# Altium schematic sheet POWER.SchDoc: Peso
size A4; ApprovedBy: Adolfo de Souza Serique; CheckedBy: Adolfo de Souza Serique; Author: Adolfo de Souza Serique; CompanyName: Agym; DrawnBy: Adolfo de Souza Serique; Engineer: Adolfo de Souza Serique; DocumentNumber: 1; Revision: 1; SheetNumber: 1; SheetTotal: 2; Size: A4
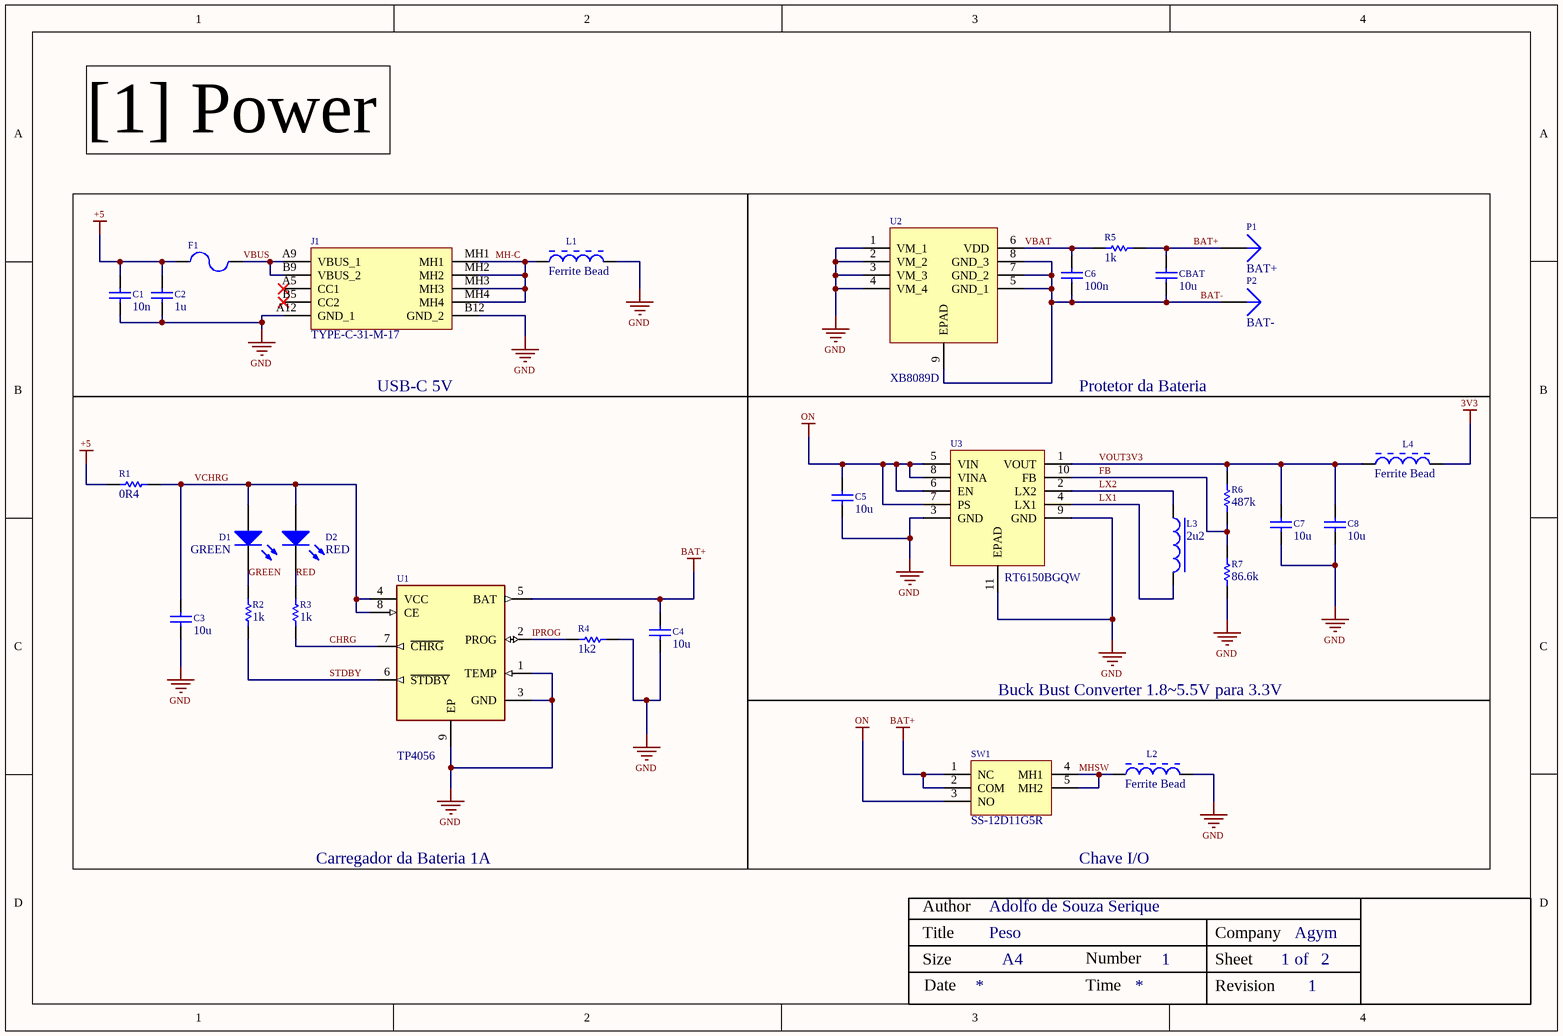
[diagram p0: POWER.SchDoc]

## Parts
C1  10n  [C2012[0805]]
C2  1u  [C2012[0805]]
C3  10u  [C3216[1206]]
C4  10u  [C3216[1206]]
C5  10u  [C2012[0805]]
C6  100n  [C2012[0805]]
C7  10u  [C2012[0805]]
C8  10u  [C2012[0805]]
CBAT  10u  [C3216[1206]]
D1  GREEN  [LED-0603-G]
D2  RED  [LED-0603-R]
F1  Resettable Fuse  [0805]  (value not drawn)
J1  TYPE-C-31-M-17  [TYPE C - 6 PINS]
L1  Ferrite Bead  [0805]
L2  Ferrite Bead  [0603]
L3  2u2  [INDUTOR 3.2x2.5mm]
L4  Ferrite Bead  [0603]
P1  BAT+  [PIN1]
P2  BAT-  [PIN1]
R1  0R4  [R3216[1206]]
R2  1k  [R1608[0603]]
R3  1k  [R1608[0603]]
R4  1k2  [R1608[0603]]
R5  1k  [R2012[0805]]
R6  487k  [R1608[0603]]
R7  86.6k  [R1608[0603]]
SW1  SS-12D11G5R  [SS-12D11G5R]
U1  TP4056  [SOP8-EPAD]
U2  XB8089D  [SOP8-EPAD]
U3  RT6150BGQW  [WDFN-10_EPAD 3x3]

## Nets
3V3: L4.2
+5: C1.1 C2.2 F1.1 R1.1
BAT+: C4.2 CBAT.2 P1.1 R5.2 SW1.1(NC) SW1.2(COM) U1.5(BAT)
GND: C1.2 C2.1 C3.1 C4.1 C5.2 C7.2 C8.2 J1.A12(GND_1) J1.B12(GND_2) L1.2 L2.2 R4.2 R7.1 U1.1(TEMP) U1.3(GND) U1.9(EP) U2.1(VM_1) U2.2(VM_2) U2.3(VM_3) U2.4(VM_4) U3.3(GND) U3.9(GND) U3.11(EPAD)
ON: C5.1 SW1.3(NO) U3.5(VIN) U3.6(EN) U3.7(PS) U3.8(VINA)
BAT-: C6.1 CBAT.1 P2.1 U2.5(GND_1) U2.7(GND_2) U2.8(GND_3) U2.9(EPAD)
CHRG: R3.1 U1.7(~{CHRG})
FB: R6.1 R7.2 U3.10(FB)
GREEN: D1.2(K) R2.2
IPROG: R4.1 U1.2(PROG)
LX1: L3.2 U3.4(LX1)
LX2: L3.1 U3.2(LX2)
MH-C: J1.MH1 J1.MH2 J1.MH3 J1.MH4 L1.1
MHSW: L2.1 SW1.4(MH1) SW1.5(MH2)
RED: D2.2(K) R3.2
STDBY: R2.1 U1.6(~{STDBY})
VBAT: C6.2 R5.1 U2.6(VDD)
VBUS: F1.2 J1.A9(VBUS_1) J1.B9(VBUS_2)
VCHRG: C3.2 D1.1(A) D2.1(A) R1.2 U1.4(VCC) U1.8(CE)
VOUT3V3: C7.1 C8.1 L4.1 R6.2 U3.1(VOUT)

Not connected (* = marked no-connect by the designer): J1 A5(CC1)* B5(CC2)*

## Notes on the sheet
- [1] Power
- USB-C 5V
- Protetor da Bateria
- Buck Bust Converter 1.8~5.5V para 3.3V
- Carregador da Bateria 1A
- Chave I/O
- Author
- Title
- Size
- Date
- Number
- Time
- Revision
- Sheet
- Company
- of

## Library data of the parts
C1 = C: CAP CER 10000PF 50V C0G/NP0 0805; Manufacturer Part Number: CL21C103JBFNNNE; Value: 1; Capacitance: 10nF; Tolerance: 5%; Dielectric: C0G; Manufacturer: *; PartNumber: *; Package Type: *; Supplier 1: Mouser; Supplier Part Number 1: 187-CL21C103JBFNNNE; RoHS: Yes; Category: Ceramic Capacitors; Stock 1: 125167; Pricing 1: 1=0,38000, 10=0,17500, 50=0,17500, 100=0,14900, 1000=0,09200, 10000=0,08000 (USD); Mount: Surface Mount; Case/Package: 0805; Case Code (Metric): 2012; Case Code (Imperial): 0805; Min Operating Temperature: -55°C; Max Operating Temperature: 125°C; Package Quantity: 1; Packaging: Tape and Reel; Voltage Rating: 50V; Series: CL; Voltage Rating (DC): 50V; Construction: Flat; Length: 2mm; Width: 0.049inch; Height: 1.25mm; Thickness: 0.053inch; Depth: 1.25mm; Radiation Hardening: No; Lead Free: Lead Free; RoHS Compliant: Yes; ComponentLink1URL: https://datasheet.ciiva.com/25787/cl21c103jbfnnne-25787207.pdf?src-supplier=Digi-Key; ComponentLink1Description: https://datasheet.ciiva.com/25787/cl21c103jbfnnne-25787207.pdf?src-supplier=Digi-Key; LCSC Part Number: C27071
C2 = C: CAP CER 1UF 50V X7R 0805; Manufacturer Part Number: CL21B105KBFNNNE; Value: 1; Tolerance: 10%; Manufacturer: *; PartNumber: *; Package Type: *; Supplier 1: Arrow Electronics; Supplier Part Number 1: CL21B105KBFNNNE; RoHS: Yes; Category: Ceramic Capacitors; Stock 1: 2742000; Pricing 1: 2000=0,01400 (USD); Mount: Surface Mount; Case/Package: 0805; Case Code (Metric): 2012; Case Code (Imperial): 0805; Min Operating Temperature: -55°C; Max Operating Temperature: 125°C; Packaging: Tape and Reel; Package Quantity: 1; Capacitance: 1uF; Voltage Rating: 50V; Dielectric: X7R; Voltage: 50V; Series: CL; Construction: Flat; Length: 2mm; Width: 0.049inch; Height: 1.25mm; Thickness: 0.053inch; Depth: 1.25mm; Radiation Hardening: No; RoHS Compliant: Yes; ComponentLink1URL: https://datasheet.ciiva.com/25800/cl21b105kbfnnne-25800291.pdf?src-supplier=Digi-Key; ComponentLink1Description: https://datasheet.ciiva.com/25800/cl21b105kbfnnne-25800291.pdf?src-supplier=Digi-Key; ComponentLink2URL: https://datasheet.ciiva.com/16449/cl21b105kbfnnne-16449003.pdf?src-supplier=Future+Electronics; ComponentLink2Description: https://datasheet.ciiva.com/16449/cl21b105kbfnnne-16449003.pdf?src-supplier=Future+Electronics; ComponentLink3URL: https://datasheet.ciiva.com/26838/getdatasheetpartid-354075-26838668.pdf?src-supplier=Verical; ComponentLink3Description: https://datasheet.ciiva.com/26838/getdatasheetpartid-354075-26838668.pdf?src-supplier=Verical; LCSC Part Number: C28323
C3 C4 CBAT = C: Ceramic capacitor SMD-1206 10000nF (10uF) /25V X7R# K 10%, Samsung, RoHS/4k/; Manufacturer Part Number: CL31B106KAHNNNE; Value: 1; Dielectric: X7R; Voltage Rating: 25V; Manufacturer: *; PartNumber: *; Package Type: *; Supplier 1: Arrow Electronics; Supplier Part Number 1: CL31B106KAHNNNE; RoHS: Yes; Category: Ceramic Capacitors; Stock 1: 6156000; Pricing 1: 2000=0,05040, 4000=0,04570, 10000=0,04200, 14000=0,04130, 50000=0,03340 (USD); Mount: Surface Mount; Case/Package: 1206; Case Code (Metric): 3216; Case Code (Imperial): 1206; Min Operating Temperature: -55°C; Max Operating Temperature: 125°C; Tolerance: 10%; Capacitance: 10uF; Packaging: Tape and Reel; Package Quantity: 1; Voltage: 25V; Series: CL; Construction: Flat; Length: 3.2mm; Width: 0.063inch; Height: 1.6mm; Thickness: 0.071inch; Depth: 1.6mm; Radiation Hardening: No; RoHS Compliant: Yes; ComponentLink1URL: https://datasheet.ciiva.com/25795/cl31b106kahnnne-25795260.pdf?src-supplier=Digi-Key; ComponentLink1Description: https://datasheet.ciiva.com/25795/cl31b106kahnnne-25795260.pdf?src-supplier=Digi-Key; ComponentLink2URL: https://datasheet.ciiva.com/26838/getdatasheetpartid-356415-26838914.pdf?src-supplier=Verical; ComponentLink2Description: https://datasheet.ciiva.com/26838/getdatasheetpartid-356415-26838914.pdf?src-supplier=Verical; ComponentLink3URL: https://datasheet.ciiva.com/16498/cl03a105mq3csnc-16498474.pdf?src-supplier=Future+Electronics; ComponentLink3Description: https://datasheet.ciiva.com/16498/cl03a105mq3csnc-16498474.pdf?src-supplier=Future+Electronics; LCSC Part Number: C14860
C5 C7 C8 = C: Cap Ceramic 10uF 16V X7R 10% SMD 0805 125°C Emboss T/R; Manufacturer Part Number: CL21B106KOQNNNE; Value: 1; Manufacturer: *; PartNumber: *; Package Type: *; Supplier 1: Arrow Electronics; Supplier Part Number 1: CL21B106KOQNNNE; RoHS: Yes; Category: Ceramic Capacitors; Stock 1: 34765; Pricing 1: 1=0,25820, 10=0,19230, 25=0,18120, 100=0,10130, 250=0,09520, 500=0,09430, 1000=0,09320, 3000=0,06070, 6000=0,05250, 15000=0,04590, 30000=0,04250 (USD); Mount: Surface Mount; Case/Package: 0805; Case Code (Metric): 2012; Case Code (Imperial): 0805; Contact Plating: Tin; Min Operating Temperature: -55°C; Max Operating Temperature: 125°C; Tolerance: 10%; Packaging: Tape and Reel; Capacitance: 10uF; Voltage Rating: 16V; Package Quantity: 1; Dielectric: X7R; Series: CL; Construction: Flat; Voltage: 16V; Length: 2mm; Width: 0.049inch; Height: 1.25mm; Thickness: 0.055inch; Depth: 1.25mm; Radiation Hardening: No; RoHS Compliant: Yes; ComponentLink1URL: https://datasheet.ciiva.com/25794/cl21b106koqnnne-25794472.pdf?src-supplier=Digi-Key; ComponentLink1Description: https://datasheet.ciiva.com/25794/cl21b106koqnnne-25794472.pdf?src-supplier=Digi-Key; ComponentLink2URL: https://datasheet.ciiva.com/16428/cl21b106koqnnne-16428887.pdf?src-supplier=Future+Electronics; ComponentLink2Description: https://datasheet.ciiva.com/16428/cl21b106koqnnne-16428887.pdf?src-supplier=Future+Electronics; ComponentLink3URL: https://datasheet.ciiva.com/26920/getdatasheetpartid-355170-26920201.pdf?src-supplier=Verical; ComponentLink3Description: https://datasheet.ciiva.com/26920/getdatasheetpartid-355170-26920201.pdf?src-supplier=Verical; LCSC Part Number: C95841
C6 = C: CAP CER 0.1UF 50V X7R 0805; Manufacturer Part Number: CL21B104JBCNNNC; Value: 1; Material: Ceramic; Capacitance: 100nF; Tolerance: 5%; Manufacturer: *; PartNumber: *; Package Type: *; Supplier 1: Arrow Electronics; Supplier Part Number 1: CL21B104JBCNNNC; RoHS: Yes; Category: Ceramic Capacitors; Stock 1: 41; Pricing 1: 1=0,08950, 25=0,06360, 50=0,03810, 100=0,02270, 250=0,02120, 500=0,01290, 4000=0,00970 (USD); Mount: Surface Mount; Case/Package: 0805; Case Code (Metric): 2012; Case Code (Imperial): 0805; Contact Plating: Tin; Min Operating Temperature: -55°C; Max Operating Temperature: 125°C; Dielectric: X7R; Package Quantity: 1; Packaging: Tape and Reel; Voltage Rating: 50V; Voltage: 50V; Series: CL; Construction: Flat; Length: 2mm; Width: 0.049inch; Height: 0.85mm; Thickness: 0.037inch; Depth: 1.25mm; Radiation Hardening: No; RoHS Compliant: Yes; ComponentLink1URL: https://datasheet.ciiva.com/25799/cl21b104jbcnnnc-25799232.pdf?src-supplier=Digi-Key; ComponentLink1Description: https://datasheet.ciiva.com/25799/cl21b104jbcnnnc-25799232.pdf?src-supplier=Digi-Key; ComponentLink2URL: https://datasheet.ciiva.com/26838/getdatasheetpartid-354073-26838656.pdf?src-supplier=Verical; ComponentLink2Description: https://datasheet.ciiva.com/26838/getdatasheetpartid-354073-26838656.pdf?src-supplier=Verical; ComponentLink3URL: https://datasheet.ciiva.com/29199/454108-da-01-en-vs-kondensator-0805-29199802.pdf?src-supplier=Conrad; ComponentLink3Description: https://datasheet.ciiva.com/29199/454108-da-01-en-vs-kondensator-0805-29199802.pdf?src-supplier=Conrad; ComponentLink4URL: https://datasheet.ciiva.com/16508/hsm00000015872757-16508637.pdf?src-supplier=Future+Electronics; ComponentLink4Description: https://datasheet.ciiva.com/16508/hsm00000015872757-16508637.pdf?src-supplier=Future+Electronics; LCSC Part Number: C62912
D1 = LED: Manufacturer: Yongyu Photoelectric; Manufacturer Part Number: SZYY0603G; Package Type: 0603; LCSC Part Number: C434420; Supplier Part Number 1: SZYY0603G
D2 = LED: Manufacturer: Yongyu Photoelectric; Manufacturer Part Number: SZYY0603R; Package Type: 0603; LCSC Part Number: C434419; Supplier Part Number 1: SZYY0603R
F1 = Resettable Fuse: Manufacturer: DOWO; Manufacturer Part Number: SMD0805-110; LCSC Part Number: C70062; Supplier Part Number 1: SMD0805-110
J1 = TYPE-C-31-M-17: 6 Pins USB Type C; Manufacturer: Korean Hroparts Elec; Datasheet Link: https://datasheet.lcsc.com/szlcsc/1903211732_Korean-Hroparts-Elec-TYPE-C-31-M-17_C283540.pdf; Manufacturer Part Number: TYPE-C-31-M-17; Supplier Part Number 1: TYPE-C-31-M-17; LCSC Part Number: C283540
L1 = Ferrite Bead: Ferrite Beads Multi-Layer 220Ohm 25% 100MHz 2A 45mOhm DCR 0805 Paper T/R; Manufacturer: Murata; Manufacturer Part Number: BLM21PG221SN1D; Material: Ferrite,Steel; Impedance: 220R; Number of Lines: 1; DC Resistance (DCR): 45mR; Shielding: Unshielded; LCSC Part Number: C85840; Supplier 1: RSComponents; Supplier Part Number 1: 7241532; RoHS: Yes; Category: Ferrite Beads and Chips; Stock 1: 3700; Pricing 1: 25=0,05900, 500=0,05000, 1000=0,04400, 2500=0,03800, 5000=0,03600 (GBP); Case/Package: 0805; Number of Pins: 2; Core Material: Ferrite; Case Code (Metric): 2012; Case Code (Imperial): 0805; Contact Plating: Tin,Matte; Min Operating Temperature: -55°C; Max Operating Temperature: 125°C; Package Quantity: 1; Tolerance: 25%; Max Current Rating: 2A; Packaging: Tape and Reel; Current Rating: 2A; Max DC Current: 2A; Termination: SMD/SMT; Test Frequency: 100MHz; DC Current: 2A; Frequency: 100MHz; Number of Circuits: 1; Current: 2A; Series: BLM21P; DC Resistance-Max: 45mR; Length: 2mm; Width: 1.25mm; Height: 0.85mm; Depth: 1.25mm; Radiation Hardening: No; REACH SVHC: No SVHC; Military Standard: Not; Lead Free: Lead Free; RoHS Compliant: Yes; ComponentLink1URL: https://datasheet.ciiva.com/30514/1845321-30514028.pdf?src-supplier=Jameco; ComponentLink1Description: https://datasheet.ciiva.com/30514/1845321-30514028.pdf?src-supplier=Jameco; ComponentLink2URL: https://datasheet.ciiva.com/1012/l0110s0100blm21p-1012288.pdf?src-supplier=Digi-Key; ComponentLink2Description: https://datasheet.ciiva.com/1012/l0110s0100blm21p-1012288.pdf?src-supplier=Digi-Key; ComponentLink3URL: https://datasheet.ciiva.com/11799/0900766b81275e31-11799232.pdf?src-supplier=RSComponents; ComponentLink3Description: https://datasheet.ciiva.com/11799/0900766b81275e31-11799232.pdf?src-supplier=RSComponents; ComponentLink4URL: https://datasheet.ciiva.com/29348/442529-da-01-en-chip-drossel-0805-220r-2000ma-2-0x1-25mm-29348007.pdf?src-supplier=Conrad; ComponentLink4Description: https://datasheet.ciiva.com/29348/442529-da-01-en-chip-drossel-0805-220r-2000ma-2-0x1-25mm-29348007.pdf?src-supplier=Conrad; ComponentLink5URL: https://datasheet.ciiva.com/8021/1756152-8021596.pdf?src-supplier=Element14; ComponentLink5Description: https://datasheet.ciiva.com/8021/1756152-8021596.pdf?src-supplier=Element14; ComponentLink6URL: https://datasheet.ciiva.com/8021/1756152-8021598.pdf?src-supplier=Element14; ComponentLink6Description: https://datasheet.ciiva.com/8021/1756152-8021598.pdf?src-supplier=Element14; ComponentLink7URL: https://datasheet.ciiva.com/14122/anblm21p-data-e-14122214.pdf?src-supplier=Distrelec; ComponentLink7Description: https://datasheet.ciiva.com/14122/anblm21p-data-e-14122214.pdf?src-supplier=Distrelec; ComponentLink8URL: https://datasheet.ciiva.com/1012/l0110s0100blm21p-1012287.pdf?src-supplier=Digi-Key; ComponentLink8Description: https://datasheet.ciiva.com/1012/l0110s0100blm21p-1012287.pdf?src-supplier=Digi-Key; ComponentLink9URL: https://datasheet.ciiva.com/1012/l0110s0100blm21p-1012289.pdf?src-supplier=Digi-Key; ComponentLink9Description: https://datasheet.ciiva.com/1012/l0110s0100blm21p-1012289.pdf?src-supplier=Digi-Key; ComponentLink10URL: https://datasheet.ciiva.com/3081/l0110s0100blm21p-3081655.pdf?src-supplier=Avnet; ComponentLink10Description: https://datasheet.ciiva.com/3081/l0110s0100blm21p-3081655.pdf?src-supplier=Avnet; ComponentLink11URL: https://datasheet.ciiva.com/16215/l0110s0100blm21p-16215194.pdf?src-supplier=Future+Electronics; ComponentLink11Description: https://datasheet.ciiva.com/16215/l0110s0100blm21p-16215194.pdf?src-supplier=Future+Electronics
L2 L4 = Ferrite Bead: Ferrite Beads Multi-Layer 220Ohm 25% 100MHz 1.4A 100mOhm DCR 0603 Paper T/R; Manufacturer: TDK EPCOS; Manufacturer Part Number: MPZ1608S601ATA00; Manufacturer Series: BLM18P; Impedance: 600R; DC Resistance (DCR): 150mR; Max DC Current: 1A; Material: Steel,Ferrite; Resistance: 100mR; ESR (Equivalent Series Resistance): 220R; Number of Lines: 1; Shielding: Unshielded; LCSC Part Number: C80165; Supplier 1: Mouser; Supplier Part Number 1: 810-MPZ1608S601ATA00; RoHS: Yes; Category: Ferrite Beads and Chips; Stock 1: 23; Pricing 1: 1=0,15000, 10=0,15000, 50=0,15000, 100=0,15000, 1000=0,15000, 10000=0,15000 (USD); Mount: Surface Mount; Case/Package: 0603; Core Material: Ferrite; Case Code (Metric): 1608; Case Code (Imperial): 0603; Weight: 7.1E-05oz; Min Operating Temperature: -55°C; Max Operating Temperature: 125°C; Tolerance: 25%; Termination: SMD/SMT; Packaging: Tape and Reel; Package Quantity: 4000; Current Rating: 1A; Test Frequency: 100MHz; Series: MPZ; Length: 0.063inch; Width: 0.8mm; Height: 0.8mm; Depth: 0.8mm; RoHS Compliant: Yes; REACH SVHC: No SVHC; Lead Free: Lead Free; ComponentLink1URL: https://datasheet.ciiva.com/46381/1795297-46381701.pdf?src-supplier=Element14; ComponentLink1Description: https://datasheet.ciiva.com/46381/1795297-46381701.pdf?src-supplier=Element14; ComponentLink2URL: https://datasheet.ciiva.com/46634/beads-commercial-power-mpz-en-46634462.pdf?src-supplier=Digi-Key; ComponentLink2Description: https://datasheet.ciiva.com/46634/beads-commercial-power-mpz-en-46634462.pdf?src-supplier=Digi-Key; ComponentLink3URL: https://datasheet.ciiva.com/46634/beads-commercial-power-mpz-en-46634518.pdf?src-supplier=Digi-Key; ComponentLink3Description: https://datasheet.ciiva.com/46634/beads-commercial-power-mpz-en-46634518.pdf?src-supplier=Digi-Key; ComponentLink4URL: https://datasheet.ciiva.com/46634/beads-commercial-power-mpz-en-46634494.pdf?src-supplier=Digi-Key; ComponentLink4Description: https://datasheet.ciiva.com/46634/beads-commercial-power-mpz-en-46634494.pdf?src-supplier=Digi-Key; Supplier 2: Arrow Electronics; Supplier Part Number 2: BLM18PG221SN1D; Stock 2: 760; Pricing 2: 1=0,09530, 10=0,06790, 25=0,06440, 50=0,05150, 100=0,03370, 250=0,03340, 500=0,03250 (USD); Number of Pins: 2; Max Current Rating: 1.4A; DC Current: 1.4A; Number of Circuits: 1; Number of Functions: 1; DC Resistance-Max: 100mR; Radiation Hardening: No; ComponentLink5URL: https://datasheet.ciiva.com/19458/1845030-19458417.pdf?src-supplier=Jameco; ComponentLink5Description: https://datasheet.ciiva.com/19458/1845030-19458417.pdf?src-supplier=Jameco; ComponentLink6URL: https://datasheet.ciiva.com/11800/0900766b81275ca5-11800851.pdf?src-supplier=RSComponents; ComponentLink6Description: https://datasheet.ciiva.com/11800/0900766b81275ca5-11800851.pdf?src-supplier=RSComponents; ComponentLink7URL: https://datasheet.ciiva.com/29347/442391-da-01-en-chip-drossel-0603-220r-1400ma-1-6x0-8mm-29347986.pdf?src-supplier=Conrad; ComponentLink7Description: https://datasheet.ciiva.com/29347/442391-da-01-en-chip-drossel-0603-220r-1400ma-1-6x0-8mm-29347986.pdf?src-supplier=Conrad; ComponentLink8URL: https://datasheet.ciiva.com/8021/5148-8021482.pdf?src-supplier=Element14; ComponentLink8Description: https://datasheet.ciiva.com/8021/5148-8021482.pdf?src-supplier=Element14; ComponentLink9URL: https://datasheet.ciiva.com/8021/5148-8021479.pdf?src-supplier=Element14; ComponentLink9Description: https://datasheet.ciiva.com/8021/5148-8021479.pdf?src-supplier=Element14; ComponentLink10URL: https://datasheet.ciiva.com/14122/blm-series-eng-tds-14122909.pdf?src-supplier=Distrelec; ComponentLink10Description: https://datasheet.ciiva.com/14122/blm-series-eng-tds-14122909.pdf?src-supplier=Distrelec; ComponentLink11URL: https://datasheet.ciiva.com/1012/l0110s0100blm18p-1012162.pdf?src-supplier=Digi-Key; ComponentLink11Description: https://datasheet.ciiva.com/1012/l0110s0100blm18p-1012162.pdf?src-supplier=Digi-Key; ComponentLink12URL: https://datasheet.ciiva.com/1012/l0110s0100blm18p-1012161.pdf?src-supplier=Digi-Key; ComponentLink12Description: https://datasheet.ciiva.com/1012/l0110s0100blm18p-1012161.pdf?src-supplier=Digi-Key; ComponentLink13URL: https://datasheet.ciiva.com/1012/l0110s0100blm18p-1012163.pdf?src-supplier=Digi-Key; ComponentLink13Description: https://datasheet.ciiva.com/1012/l0110s0100blm18p-1012163.pdf?src-supplier=Digi-Key; ComponentLink14URL: https://datasheet.ciiva.com/3081/l0110s0100blm18p-3081633.pdf?src-supplier=Avnet; ComponentLink14Description: https://datasheet.ciiva.com/3081/l0110s0100blm18p-3081633.pdf?src-supplier=Avnet; ComponentLink15URL: https://datasheet.ciiva.com/16205/l0110s0100blm18p-16205422.pdf?src-supplier=Future+Electronics; ComponentLink15Description: https://datasheet.ciiva.com/16205/l0110s0100blm18p-16205422.pdf?src-supplier=Future+Electronics
L3 = Indutor: Manufacturer Part Number: HEI322512A-2R2M-Q8; Value: 2u2H; LCSC Part Number: C285914; Supplier Part Number 1: HEI322512A-2R2M-Q8
P1 P2 = Plug: LatestRevisionDate: 17-Jul-2002; LatestRevisionNote: Re-released for DXP Platform.; Publisher: Altium Limited
R1 = R: Resistor; Manufacturer: UNI-ROYAL; Manufacturer Part Number: 1206W4F400LT5E; Package Type: 1206; Value: 0R4; LCSC Part Number: C247521
R2 R3 = R: ERJ Series 0603 1 kOhm 0.2 W ±0.1 % ±50ppm/°C Thick Film Chip Resistor; Manufacturer Part Number: ERJ-PB3B1001V; Value: 0; Resistance: 1kR; Tolerance: 0.1%; Max Power Dissipation: 200mW; Manufacturer: *; PartNumber: *; Package Type: *; Supplier 1: Arrow Electronics; Supplier Part Number 1: ERJ-PB3B1001V; RoHS: Yes; Category: Chip SMD Resistors; Stock 1: 430; Pricing 1: 1=0,24170, 10=0,17640, 25=0,13980, 100=0,08630, 250=0,06400 (USD); Case/Package: 0603; Case Code (Metric): 1608; Case Code (Imperial): 0603; Min Operating Temperature: -55°C; Max Operating Temperature: 155°C; Packaging: Tape and Reel; Resistor Type: Thick Film; Number of Terminations: 2; Temperature Coefficient: 50ppm/°C; Features: Automotive AEC-Q200; Length: 0.063inch; Width: 0.032inch; Height - Seated (Max): 0.022inch; ComponentLink1URL: https://industrial.panasonic.com/sa/system/files/data/download/catalog/id_fixed-resistors_e_2.pdf?src-supplier=Digi-Key; ComponentLink1Description: https://industrial.panasonic.com/sa/system/files/data/download/catalog/id_fixed-resistors_e_2.pdf?src-supplier=Digi-Key; ComponentLink2URL: https://industrial.panasonic.com/cdbs/www-data/pdf/RDM0000/DMM0000COL5.pdf?src-supplier=Digi-Key; ComponentLink2Description: https://industrial.panasonic.com/cdbs/www-data/pdf/RDM0000/DMM0000COL5.pdf?src-supplier=Digi-Key; ComponentLink3URL: http://www.farnell.com/datasheets/2883953.pdf?src-supplier=Newark; ComponentLink3Description: http://www.farnell.com/datasheets/2883953.pdf?src-supplier=Newark; LCSC Part Number: C193680
R4 = R: Resistor; Manufacturer: UNI-ROYAL; Manufacturer Part Number: 0603WAF1201T5E; Value: 1.2k; Package Type: 0603; LCSC Part Number: C22765
R5 = R: Res Thick Film 0805 1K Ohm 1% 0.4W ±100ppm/C Epoxy Resin Pad SMD Automotive T/R; Manufacturer Part Number: ESR10EZPF1001; Value: 0; Resistance: 1kR; Temperature Coefficient: 100ppm/°C; Power Rating: 400mW; Manufacturer: *; PartNumber: *; Package Type: *; Supplier 1: Arrow Electronics; Supplier Part Number 1: ESR10EZPF1001; RoHS: Yes; Category: Chip SMD Resistors; Stock 1: 16; Pricing 1: 1=0,13760, 10=0,12760 (USD); Case/Package: 0805; Case Code (Metric): 2012; Case Code (Imperial): 0805; Size Code: 0805; Min Operating Temperature: -55°C; Max Operating Temperature: 155°C; Tolerance: 1%; Packaging: Tape and Reel; Resistor Type: Thick Film; Package Quantity: 1; Number of Terminations: 2; Max Power Dissipation: 400mW; Features: Automotive AEC-Q200; Series: ESR; Length: 0.079inch; Width: 0.049inch; Height: 0.026inch; Lead Free: Lead Free; RoHS Compliant: Yes; ComponentLink1URL: https://datasheet.ciiva.com/2470/esr-2470004.pdf?src-supplier=Digi-Key; ComponentLink1Description: https://datasheet.ciiva.com/2470/esr-2470004.pdf?src-supplier=Digi-Key; ComponentLink2URL: https://datasheet.ciiva.com/2470/esr-2470005.pdf?src-supplier=Digi-Key; ComponentLink2Description: https://datasheet.ciiva.com/2470/esr-2470005.pdf?src-supplier=Digi-Key; ComponentLink3URL: https://datasheet.ciiva.com/2470/esr-2470003.pdf?src-supplier=Digi-Key; ComponentLink3Description: https://datasheet.ciiva.com/2470/esr-2470003.pdf?src-supplier=Digi-Key; LCSC Part Number: C510097
R6 = R: Res Thick Film 0603 487K Ohm 1% 1/10W ±100ppm/°C Molded SMD Punched Carrier T/R; Manufacturer Part Number: ERJ-3EKF4873V; Value: 0; Resistance: 487kR; Power Rating: 100mW; Voltage Rating: 75V; Voltage Rating (DC): 50V; Manufacturer: *; PartNumber: *; Package Type: *; Supplier 1: Arrow Electronics; Supplier Part Number 1: ERJ-3EKF4873V; RoHS: Yes; Category: Chip SMD Resistors; Stock 1: 41000; Pricing 1: 1=0,05150, 10=0,02080, 25=0,02070, 100=0,00860, 250=0,00850, 500=0,00840, 1000=0,00470, 3000=0,00370, 6000=0,00350, 15000=0,00330, 30000=0,00310 (USD); Mount: Surface Mount; Case/Package: 0603; Case Code (Metric): 1608; Case Code (Imperial): 0603; Contact Plating: Tin; Min Operating Temperature: -55°C; Max Operating Temperature: 155°C; Tolerance: 1%; Packaging: Tape and Reel; Package Quantity: 1; Resistor Type: Thick Film; Number of Terminations: 2; Termination: SMD/SMT; Temperature Coefficient: 100ppm/°C; Max Power Dissipation: 100mW; Features: Automotive AEC-Q200; Series: ERJ; Construction: Rectangular; Resistance Tolerance: 1%; Length: 1.6mm; Width: 0.031inch; Height: 0.022inch; Depth: 0.8mm; REACH SVHC: Yes; Military Standard: Not; Lead Free: Lead Free; RoHS Compliant: Yes; ComponentLink1URL: https://datasheet.ciiva.com/22673/1678782-22673994.pdf?src-supplier=Element14; ComponentLink1Description: https://datasheet.ciiva.com/22673/1678782-22673994.pdf?src-supplier=Element14; ComponentLink2URL: https://datasheet.ciiva.com/46444/1678782-46444760.pdf?src-supplier=Element14; ComponentLink2Description: https://datasheet.ciiva.com/46444/1678782-46444760.pdf?src-supplier=Element14; ComponentLink3URL: https://datasheet.ciiva.com/24070/aoa0000ce2-24070633.pdf?src-supplier=Mouser; ComponentLink3Description: https://datasheet.ciiva.com/24070/aoa0000ce2-24070633.pdf?src-supplier=Mouser; ComponentLink4URL: https://datasheet.ciiva.com/9181/aoa0000ce2-9181606.pdf?src-supplier=Avnet; ComponentLink4Description: https://datasheet.ciiva.com/9181/aoa0000ce2-9181606.pdf?src-supplier=Avnet; LCSC Part Number: C403250
R7 = R: Res Thick Film 0603 86.6K Ohm 1% 1/10W ±100ppm/°C Molded SMD Punched Carrier T/R; Manufacturer Part Number: ERJ-3EKF8662V; Value: 0; Resistance: 86.6kR; Power Rating: 100mW; Voltage Rating: 75V; Voltage Rating (DC): 50V; Manufacturer: *; PartNumber: *; Package Type: *; Supplier 1: Arrow Electronics; Supplier Part Number 1: ERJ-3EKF8662V; RoHS: Yes; Category: Chip SMD Resistors; Stock 1: 49975; Pricing 1: 1=0,07360, 10=0,02440, 25=0,02420, 100=0,01330, 250=0,01100, 500=0,00600, 1000=0,00590, 3000=0,00570, 6000=0,00530, 15000=0,00360 (USD); Mount: Surface Mount; Case/Package: 0603; Case Code (Metric): 1608; Case Code (Imperial): 0603; Weight: 7.1E-05oz; Contact Plating: Tin; Size Code: 0603; Min Operating Temperature: -55°C; Max Operating Temperature: 155°C; Packaging: Tape and Reel; Tolerance: 1%; Package Quantity: 1; Resistor Type: Thick Film; Number of Terminations: 2; Termination: SMD/SMT; Temperature Coefficient: 100ppm/°C; Max Power Dissipation: 100mW; Features: Automotive AEC-Q200; Series: ERJ; Resistance Tolerance: 1%; Construction: Rectangular; Length: 1.6mm; Width: 0.031inch; Height: 0.022inch; Depth: 0.8mm; Radiation Hardening: No; REACH SVHC: Unknown; Military Standard: Not; Lead Free: Lead Free; RoHS Compliant: Yes; ComponentLink1URL: https://datasheet.ciiva.com/43460/426256-43460615.pdf?src-supplier=Farnell; ComponentLink1Description: https://datasheet.ciiva.com/43460/426256-43460615.pdf?src-supplier=Farnell; ComponentLink2URL: https://datasheet.ciiva.com/6053/426256-6053226.pdf?src-supplier=Farnell; ComponentLink2Description: https://datasheet.ciiva.com/6053/426256-6053226.pdf?src-supplier=Farnell; ComponentLink3URL: https://datasheet.ciiva.com/9117/aoa0000ce2-9117210.pdf?src-supplier=Avnet; ComponentLink3Description: https://datasheet.ciiva.com/9117/aoa0000ce2-9117210.pdf?src-supplier=Avnet; ComponentLink4URL: https://datasheet.ciiva.com/9187/aoa0000ce2-9187253.pdf?src-supplier=Avnet; ComponentLink4Description: https://datasheet.ciiva.com/9187/aoa0000ce2-9187253.pdf?src-supplier=Avnet; ComponentLink5URL: https://datasheet.ciiva.com/24161/aoa0000ce2-24161295.pdf?src-supplier=Mouser; ComponentLink5Description: https://datasheet.ciiva.com/24161/aoa0000ce2-24161295.pdf?src-supplier=Mouser; ComponentLink6URL: https://datasheet.ciiva.com/30081/aoa0000ce2-30081342.pdf?src-supplier=Onlinecomponents.com; ComponentLink6Description: https://datasheet.ciiva.com/30081/aoa0000ce2-30081342.pdf?src-supplier=Onlinecomponents.com; ComponentLink7URL: https://datasheet.ciiva.com/28548/1678782-28548550.pdf?src-supplier=Element14; ComponentLink7Description: https://datasheet.ciiva.com/28548/1678782-28548550.pdf?src-supplier=Element14; ComponentLink8URL: https://datasheet.ciiva.com/28677/1678782-28677695.pdf?src-supplier=Element14; ComponentLink8Description: https://datasheet.ciiva.com/28677/1678782-28677695.pdf?src-supplier=Element14; ComponentLink9URL: https://datasheet.ciiva.com/46389/426256-46389798.pdf?src-supplier=Element14; ComponentLink9Description: https://datasheet.ciiva.com/46389/426256-46389798.pdf?src-supplier=Element14; ComponentLink10URL: https://datasheet.ciiva.com/16437/aoa0000ce2-16437813.pdf?src-supplier=Future+Electronics; ComponentLink10Description: https://datasheet.ciiva.com/16437/aoa0000ce2-16437813.pdf?src-supplier=Future+Electronics; ComponentLink11URL: https://datasheet.ciiva.com/16777/70260748-16777375.pdf?src-supplier=Allied+Electronics; ComponentLink11Description: https://datasheet.ciiva.com/16777/70260748-16777375.pdf?src-supplier=Allied+Electronics; ComponentLink12URL: https://datasheet.ciiva.com/16785/70260748-16785303.pdf?src-supplier=Allied+Electronics; ComponentLink12Description: https://datasheet.ciiva.com/16785/70260748-16785303.pdf?src-supplier=Allied+Electronics; ComponentLink13URL: https://datasheet.ciiva.com/46377/426256-46377692.pdf?src-supplier=Element14; ComponentLink13Description: https://datasheet.ciiva.com/46377/426256-46377692.pdf?src-supplier=Element14; LCSC Part Number: C403381
SW1 = SS-12D11G5R: Slide Switch; Manufacturer: XKB Industrial Precision; Datasheet Link: https://datasheet.lcsc.com/szlcsc/2002271814_XKB-Enterprise-SS-12D11G5R_C388633.pdf; Manufacturer Part Number: SS-12D11G5R; Supplier Part Number 1: SS-12D11G5R; LCSC Part Number: C692484
U1 = TP4056: Carregador bateria 1A; Manufacturer: TPOWER; Manufacturer Part Number: TP4056; Supplier Part Number 1: TP4056; LCSC Part Number: C382139
U2 = XB8089D: BAT Protection; Manufacturer: Xysemi; Datasheet Link: https://datasheet.lcsc.com/szlcsc/1811151452_XySemi-XB8089D_C79928.pdf; Manufacturer Part Number: XB8089D; Supplier Part Number 1: XB8089D; LCSC Part Number: C79928
U3 = RT6150BGQW: Step-down-Step-Up 1.8V~5.5V 1.8V~5.5V 800mA 1.6A 1MHz; Manufacturer: Richtek Tech; Manufacturer Part Number: RT6150BGQW; Supplier Part Number 1: RT6150BGQW; LCSC Part Number: C147972